# EAGLE design ServoBoard-Rev4 (EAGLE 9.5.1)
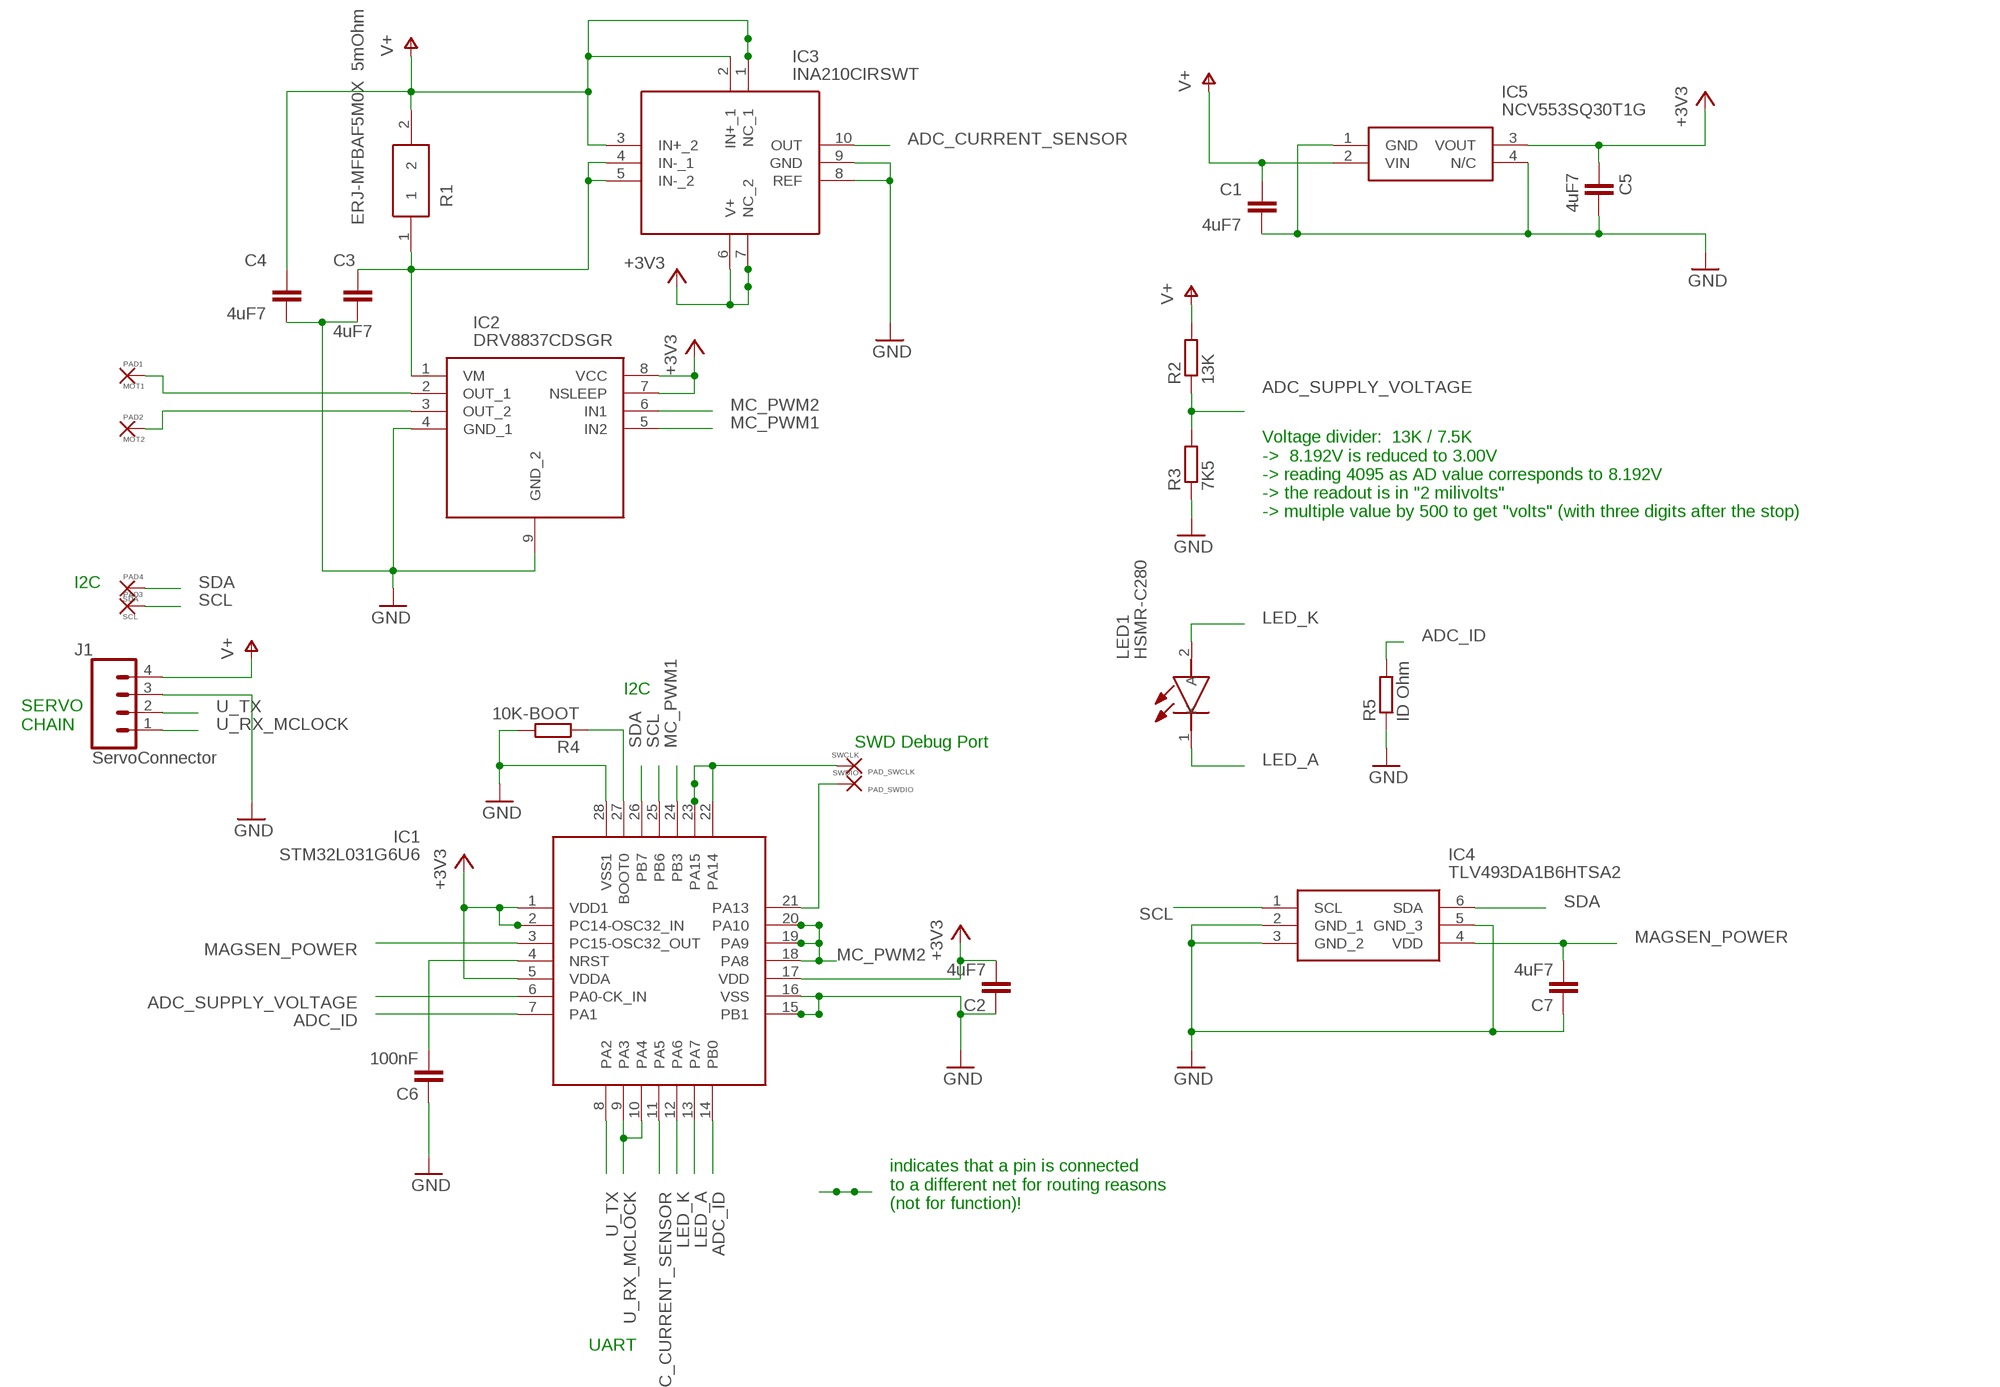
[diagram p0: schematic, sheet 1]

## Parts
C1  4uF7  C-EUC0402  [C0402]
C2  4uF7  C-EUC0402  [C0402]
C3  4uF7  C-EUC0402  [C0402]
C4  4uF7  C-EUC0402  [C0402]
C5  4uF7  C-EUC0402  [C0402]
C6  100nF  C-EUC0201  [C0201]
C7  4uF7  C-EUC0402  [C0402]
IC1  STM32L031G6U6  [QFN50P400X400X60-28N]
IC2  DRV8837CDSGR  [SON50P200X200X80-9N]
IC3  INA210CIRSWT  [QFN40P140X180X55-10N]
IC4  TLV493DA1B6HTSA2  [SOT95P250X110-6N]
IC5  NCV553SQ30T1G  [NCP563SQ18T1G]
J1  ServoConnector  CONN_04SMD2  [JST04_SH_1MM]
LED1  HSMR-C280  [LEDC1005X50N]
PAD1  MOT1  SMD-PAD12X07  [SMD12X07]
PAD2  MOT2  SMD-PAD12X07  [SMD12X07]
PAD3  SCL  SMD-PAD14X06  [SMD14X06]
PAD4  SDA  SMD-PAD14X06  [SMD14X06]
PAD_SWCLK  SWCLK  SMD-PAD06X06  [SMD06X06]
PAD_SWDIO  SWDIO  SMD-PAD06X06  [SMD06X06]
R1  ERJ-MFBAF5M0X 5mOhm  ERJ-MFBAF5M0X  [RESM106X40N]
R2  13K  R-EU_R0402  [R0402]
R3  7K5  R-EU_R0402  [R0402]
R4  10K-BOOT  R-EU_R0402  [R0402]
R5  ID Ohm  R-EU_R0402  [R0402]

## Nets
+3V3: C2.2 C5.1 IC1.1(VDD1) IC1.2(PC14-OSC32_IN) IC1.5(VDDA) IC1.17(VDD) IC2.7(NSLEEP) IC2.8(VCC) IC3.6(V+) IC3.7(NC_2) IC5.3(VOUT)
ADC_CURRENT_SENSOR: IC1.11(PA5) IC3.10(OUT)
ADC_ID: IC1.7(PA1) IC1.14(PB0) R5.2
ADC_SUPPLY_VOLTAGE: IC1.6(PA0-CK_IN) R2.1 R3.2
BOOT0: IC1.27(BOOT0) R4.1
GND: C1.2 C2.1 C3.2 C4.2 C5.2 C6.1 C7.1 IC1.15(PB1) IC1.16(VSS) IC1.28(VSS1) IC2.4(GND_1) IC2.9(GND_2) IC3.8(REF) IC3.9(GND) IC4.2(GND_1) IC4.3(GND_2) IC4.5(GND_3) IC5.1(GND) IC5.4(N/C) J1.3 R3.1 R4.2 R5.1
LED_A: IC1.13(PA7) LED1.1(K)
LED_K: IC1.12(PA6) LED1.2(A)
MAGSEN_POWER: C7.2 IC1.3(PC15-OSC32_OUT) IC4.4(VDD)
MC_PWM1: IC1.24(PB3) IC2.5(IN2)
MC_PWM2: IC1.18(PA8) IC1.19(PA9) IC1.20(PA10) IC2.6(IN1)
MOTOR_1: IC2.2(OUT_1) PAD1.1(P)
MOTOR_2: IC2.3(OUT_2) PAD2.1(P)
NRST: C6.2 IC1.4(NRST)
SCL: IC1.25(PB6) IC4.1(SCL) PAD3.1(P)
SDA: IC1.26(PB7) IC4.6(SDA) PAD4.1(P)
SWCLK: IC1.22(PA14) IC1.23(PA15) PAD_SWCLK.1(P)
SWDIO: IC1.21(PA13) PAD_SWDIO.1(P)
U_RX_MCLOCK: IC1.9(PA3) IC1.10(PA4) J1.1
U_TX: IC1.8(PA2) J1.2
V+: C1.1 C4.1 IC3.1(NC_1) IC3.2(IN+_1) IC3.3(IN+_2) IC5.2(VIN) J1.4 R1.2 R2.2
V_SENSOR: C3.1 IC2.1(VM) IC3.4(IN-_1) IC3.5(IN-_2) R1.1

## Notes on the sheet
- Voltage divider:  13K / 7.5K 
  ->  8.192V is reduced to 3.00V
  -> reading 4095 as AD value corresponds to 8.192V
  -> the readout is in "2 milivolts"
  -> multiple value by 500 to get "volts" (with three digits after the stop)
- I2C
- I2C
- SERVO
  CHAIN
- SWD Debug Port
- indicates that a pin is connected
  to a different net for routing reasons
  (not for function)!
- UART

## Library data of the parts
C1-C7 = rcl:C-EU: CAPACITOR, European symbol; SPICEPREFIX: C
IC1 = HBPMouse:STM32L031G6U6: ARM Microcontrollers - MCU Ultra-low-power ARM Cortex-M0+ MCU with 32-Kbytes Flash, 32 MHz CPU Source: Datasheet <http://www.mouser.com/datasheet/2/389/stm32l031g4-956322.pdf>; DESCRIPTION: ARM Microcontrollers - MCU Ultra-low-power ARM Cortex-M0+ MCU with 32-Kbytes Flash, 32 MHz CPU; HEIGHT: 0.6mm; MANUFACTURER_NAME: STMicroelectronics; MANUFACTURER_PART_NUMBER: STM32L031G6U6; MOUSER_PART_NUMBER: 511-STM32L031G6U6; MOUSER_PRICE-STOCK: https://www.mouser.com/Search/Refine.aspx?Keyword=511-STM32L031G6U6
IC2 = HBPMouse:DRV8837CDSGR: 1A Low-Voltage H-Bridge Driver Source: Datasheet <http://www.ti.com/lit/gpn/drv8837c>; DESCRIPTION: 1A Low-Voltage H-Bridge Driver; HEIGHT: 0.8mm; MANUFACTURER_NAME: Texas Instruments; MANUFACTURER_PART_NUMBER: DRV8837CDSGR; MOUSER_PART_NUMBER: 595-DRV8837CDSGR; MOUSER_PRICE-STOCK: https://www.mouser.com/Search/Refine.aspx?Keyword=595-DRV8837CDSGR
IC3 = HBPMouse:INA210CIRSWT: Current Sense Amplifiers 26-V, Bi-Directional, Zero-Drift, High Accuracy, Low-/High-Side, Voltage Out Current Shunt Monitor 10-UQFN -40 to 125 Source: Datasheet <http://www.ti.com/lit/ds/sbos437j/sbos437j.pdf>; DESCRIPTION: Current Sense Amplifiers 26-V, Bi-Directional, Zero-Drift, High Accuracy, Low-/High-Side, Voltage Out Current Shunt Monitor 10-UQFN -40 to 125; HEIGHT: 0.55mm; MANUFACTURER_NAME: Texas Instruments; MANUFACTURER_PART_NUMBER: INA210CIRSWT; MOUSER_PART_NUMBER: 595-INA210CIRSWT; MOUSER_PRICE-STOCK: https://www.mouser.com/Search/Refine.aspx?Keyword=595-INA210CIRSWT
IC4 = HBPMouse:TLV493DA1B6HTSA2: Board Mount Hall Effect / 3D Magnetic Sensor Source: Datasheet <https://componentsearchengine.com/Datasheets/1/TLV493DA1B6HTSA2.pdf>; DESCRIPTION: Board Mount Hall Effect / 3D Magnetic Sensor; HEIGHT: 1.1mm; MANUFACTURER_NAME: Infineon; MANUFACTURER_PART_NUMBER: TLV493DA1B6HTSA2; MOUSER_PART_NUMBER: 726-TLV493DA1B6HTSA2; MOUSER_PRICE-STOCK: https://www.mouser.com/Search/Refine.aspx?Keyword=726-TLV493DA1B6HTSA2
IC5 = HBPMouse:NCV553SQ30T1G: LDO Voltage Regulators LDO LINEAR REGULATOR Source: Datasheet <https://componentsearchengine.com/Datasheets/1/NCV553SQ30T1G.pdf>; DESCRIPTION: LDO Voltage Regulators LDO LINEAR REGULATOR; HEIGHT: mm; MANUFACTURER_NAME: ON Semiconductor; MANUFACTURER_PART_NUMBER: NCV553SQ30T1G; MOUSER_PART_NUMBER: 863-NCV553SQ30T1G; MOUSER_PRICE-STOCK: https://www.mouser.com/Search/Refine.aspx?Keyword=863-NCV553SQ30T1G
J1 = HBPMouse:CONN_04: Multi connection point. Often used as Generic Header-pin footprint for 0.1 inch spaced/style header connections On any of the 0.1 inch spaced packages, you can populate with these: Break Away Headers - Straight <https://www.sparkfun.com/products/116> (PRT-00116) Break Away Male Headers - Right Angle <https://www.sparkfun.com/products/553> (PRT-00553) Female Headers <https://www.sparkfun.com/products/115> (PRT-00115) Break Away Headers - Machine Pin <https://www.sparkfun.com/products/117> (PRT-00117) Break Away Female Headers - Swiss Machine Pin <https://www.sparkfun.com/products/743> (PRT-00743) For SCREWTERMINALS and SPRING TERMINALS visit here: Screw Terimnals on SparkFun.com <https://www.sparkfun.com/search/results?term=Screw+Terminals> (5mm/3.5mm/2.54mm spacing) This device is also useful as a general connection point to wire up your design to another part of your project. Our various solder wires solder well into these plated through hole pads. Hook-Up Wire - Assortment (Stranded, 22 AWG) <https://www.sparkfun.com/products/11375> (PRT-11375) Hook-Up Wire - Assortment (Solid Core, 22 AWG) <https://www.sparkfun.com/products/11367> (PRT-11367) View the entire wire category on our website here <https://www.sparkfun.com/categories/141> Special notes: Molex polarized connector foot print use with SKU : PRT-08231 with associated crimp pins and housings. 1MM SMD Version SKU: PRT-10208; PROD_ID: CONN-10310; SF_ID: PRT-10208
LED1 = HBPMouse:HSMR-C280: BROADCOM LIMITED - HSMR-C280 - LED, BLUE, 80MCD, 465NM, 0402 Source: Datasheet <https://media.digikey.com/pdf/Data Sheets/Avago PDFs/HSMR-C280.pdf>; DESCRIPTION: BROADCOM LIMITED - HSMR-C280 - LED, BLUE, 80MCD, 465NM, 0402; HEIGHT: 0.5mm; MANUFACTURER_NAME: Avago Technologies; MANUFACTURER_PART_NUMBER: HSMR-C280; MOUSER_PART_NUMBER: 630-HSMR-C280; MOUSER_PRICE-STOCK: https://www.mouser.com/Search/Refine.aspx?Keyword=630-HSMR-C280
PAD1-PAD4 PAD_SWCLK PAD_SWDIO = HBPMouse:SMD-PAD: SMD PAD
R1 = HBPMouse:ERJ-MFBAF5M0X: Current Sense Resistors - SMD 0402 1% 0.005ohm Curr Sense AEC-Q200 Source: Datasheet <https://componentsearchengine.com/Datasheets/1/ERJ-MFBAF5M0X.pdf>; DESCRIPTION: Current Sense Resistors - SMD 0402 1% 0.005ohm Curr Sense AEC-Q200; HEIGHT: 0.4mm; MANUFACTURER_NAME: Panasonic; MANUFACTURER_PART_NUMBER: ERJ-MFBAF5M0X; MOUSER_PART_NUMBER: 667-ERJ-MFBAF5M0X; MOUSER_PRICE-STOCK: https://www.mouser.com/Search/Refine.aspx?Keyword=667-ERJ-MFBAF5M0X
R2-R5 = rcl:R-EU_: RESISTOR, European symbol; SPICEPREFIX: R

## Board
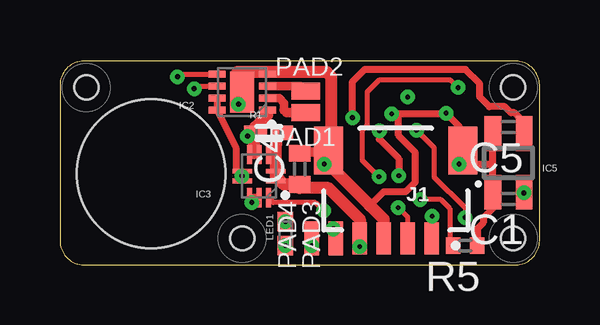
[diagram p1: board, top side]
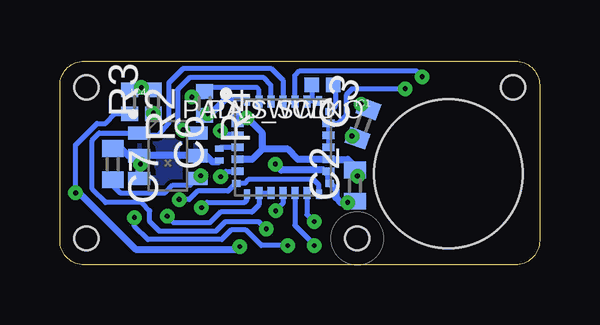
[diagram p2: board, bottom side, seen from below]

Size 20 x 8.5 mm. Coordinates in mm from the lower left corner, seen from the top.
Outline: 20,7.5 arc90 19,8.5 1,8.5 arc90 0,7.5 0,1 arc90 1,0 19,0 arc90 20,1 20,7.5
Copper layers (1*16): Top 0.035mm / dielectric 0.8mm / Bottom 0.035mm
Design rules "default *": minimum track width 0.2mm, minimum drill 0.2mm, track to track 0.15mm, track to pad 0.15mm, pad to pad 0.15mm, via to via 0.15mm, smd to smd 0mil, copper to edge 0.2mm, drill to drill 0.3mm, minimum pad ring 10mil, minimum via ring 8mil, stop-mask expansion 0.02mm, vias tented up to drill 0.5mm, thermal gap 10mil
Holes 1 mm at 1.1,7.4 7.6,1.1 18.9,1.1 18.9,7.4
Holes 6.2 mm at 3.8,3.8

### Footprints (pad centres in the part's own frame; a part is rotated, then mirrored left to right if it is on the bottom)
C0402 = smd 0.7 x 0.9: 1 -0.65,0; 2 0.65,0
C0201 = smd 0.25 x 0.35: 1 -0.25,0; 2 0.25,0
QFN50P400X400X60-28N = smd 0.4 x 0.3: 1 -1.95,1.5; 7 -1.95,-1.5; 15 1.95,-1.5; 21 1.95,1.5 | smd 0.5 x 0.3: 2 -1.9,1; 3 -1.9,0.5; 4 -1.9,0; 5 -1.9,-0.5; 6 -1.9,-1; 16 1.9,-1; 17 1.9,-0.5; 18 1.9,0; 19 1.9,0.5; 20 1.9,1 | smd 0.3 x 0.4: 8 -1.5,-1.95; 14 1.5,-1.95; 22 1.5,1.95; 28 -1.5,1.95 | smd 0.3 x 0.5: 9 -1,-1.9; 10 -0.5,-1.9; 11 0,-1.9; 12 0.5,-1.9; 13 1,-1.9; 23 1,1.9; 24 0.5,1.9; 25 0,1.9; 26 -0.5,1.9; 27 -1,1.9
SON50P200X200X80-9N = smd 0.7 x 0.3: 1 -1.05,0.75; 2 -1.05,0.25; 3 -1.05,-0.25; 4 -1.05,-0.75; 5 1.05,-0.75; 6 1.05,-0.25; 7 1.05,0.25; 8 1.05,0.75 | smd 1 x 1.7: 9 0,0
QFN40P140X180X55-10N = smd 0.8 x 0.2: 1 -0.7,0.2; 2 -0.7,-0.2; 6 0.7,-0.2; 7 0.7,0.2 | smd 0.2 x 0.8: 3 -0.4,-0.9; 4 0,-0.9; 5 0.4,-0.9; 8 0.4,0.9; 9 0,0.9; 10 -0.4,0.9
SOT95P250X110-6N = smd 0.9 x 0.55: 1 -1.2,0.95; 2 -1.2,0; 3 -1.2,-0.95; 4 1.2,-0.95; 5 1.2,0; 6 1.2,0.95
NCP563SQ18T1G = smd 0.7 x 0.9: 1 -0.65,-0.95; 2 0.65,-0.95; 3 0.65,0.95; 4 -0.65,0.95
JST04_SH_1MM = smd 0.6 x 1.35: 1 -1.5,0; 2 -0.5,0; 3 0.5,0; 4 1.5,0 | smd 1.2 x 2: NC1 2.8,-3.675; NC2 -2.8,-3.675
LEDC1005X50N = smd 0.8 x 0.65: 1 -0.5,0; 2 0.5,0
SMD12X07 = smd 0.7 x 1.2: 1 0,0
SMD14X06 = smd 0.6 x 1.4: 1 0,0
SMD06X06 = smd 0.6 x 0.6: 1 0,0
RESM106X40N = smd 0.95 x 0.6: 1 -0.55,0; 2 0.55,0
R0402 = smd 0.6 x 0.7: 1 -0.5,0; 2 0.5,0

### Placement (x,y rotation side)
C1  18.7,2.75 180 top
C2  7.7,3.3 90 bottom
C3  7.37,5.89 70 bottom
C4  10,4 90 top
C5  18.7,5.75 180 top
C6  13.35,4.6 90 bottom
C7  17.8,4.2 270 bottom
IC1  10.7,4.9 0 bottom
IC2  7.6,7.2 180 top
IC3  8.3,3.7 180 top
IC4  15.5,4.55 0 bottom
IC5  18.7,4.25 0 top
J1  14,1.1 180 top
LED1  9.4,1.3 270 top
PAD1  10.25,6.35 90 top
PAD2  10.25,7.25 270 top
PAD3  11.5,1.1 0 top
PAD4  10.5,1.1 0 top
PAD_SWCLK  9.5,7.5 90 bottom
PAD_SWDIO  8.6,7.5 90 bottom
R1  8.7,5.5 0 top
R2  17.1,6.8 270 bottom
R3  16.1,6.8 90 bottom
R4  13.97,6.73 270 bottom
R5  16.9,0.8 180 top

### Tracks (layer width: path | path; a pad name or v marks a point on that pad's centre or on a via)
+3V3  (via drill 0.2)
  Top 0.2: IC3.6 7.59,3.89 v7.59,3.7 7.59,3.51 IC3.7
  Top 0.3: IC2.7 IC2.8 7.35,4.85 7.35,3.94 v7.59,3.7 | 19.3,6 18.95,6.35 18.81,6.35 18.56,6.6 17.9,6.6 17.5,7 17.5,7.56 16.91,8.15 12.7,8.15 12.2,7.65 v12.2,6.14
  Top 0.4: IC5.3 C5.1 19.35,5.95 19.3,6
  Bottom 0.2: IC1.2 12.68,5.98 12.7,5.98
  Bottom 0.3: IC1.5 11.98,4.4 11.55,4.83 | C2.2 7.7,3.81 v7.59,3.7 7.6,3.71 7.6,4 8,4.4 IC1.17 10.07,4.4 10.5,4.83 11.55,4.83 | IC1.1 12.65,5.98 | 12.7,5.98 12.65,5.98 | 12.65,5.98 12.37,5.98 v12.2,6.14 | IC1.2 12.44,5.9 v12.2,6.14 | 11.55,4.83 11.55,5.49 v12.2,6.14
ADC_CURRENT_SENSOR  (via drill 0.2)
  Top 0.2: IC3.10 8.9,2.6 10.65,2.6 v11,2.25
  Bottom 0.2: v11,2.25 10.7,2.55 IC1.11
ADC_ID  (via drill 0.2)
  Top 0.2: v15.03,2.73 15.88,2.73 16.25,2.35 16.25,0.95 R5.2
  Bottom 0.2: v15.03,2.73 14.61,2.73 14.26,3.08 13,3.08 12.68,3.4 IC1.7 12.3,3.4 12.15,3.55 9.42,3.55 9.2,3.33 IC1.14
ADC_SUPPLY_VOLTAGE  (via drill 0.2)
  Top 0.2: v16.6,7.4 16.3,7.7 13.3,7.7 12.81,7.21 12.81,5.81 12.6,5.6 12.6,4.38 v13.3,3.67
  Bottom 0.2: v16.6,7.4 16.5,7.3 R3.2 R2.1 | v13.3,3.67 13.07,3.9 IC1.6
BOOT0  (via drill 0.2)
  Bottom 0.2: IC1.27 11.7,7.3 11.8,7.4 13.8,7.4 R4.1 | R4.1 | R4.1 13.99,7 v14.5,7
GND  (via drill 0.2)
  Top 0.2: C1.2 IC5.1 | IC3.9 8.2,2.8 | IC2.4 8.6,8 8.6,8.05
  Top 0.3: C4.2 10,4.7 | C5.2 IC5.4 18.05,4.2 | IC5.1 18.05,4.2 | v8,2.6 8,2.7 IC3.8 8.2,2.8 | C1.2 18.05,2.35 17.65,1.95 17.65,1.75 17.4,1.5 R5.1 | 18.05,4.2 v16.65,4.2 16.65,5.78 v16.1,6.33 16.07,6.3 14.12,6.3 | v13.83,6.3 14.12,6.3 | 12.93,2.48 13.49,3.04 14.41,3.04 14.81,3.44 14.81,4.71 14.12,5.4 14.12,6.3
  Top 0.4: 7.6,7.5 IC2.9 7.44,7.04 v7.44,6.7 | 10,4.7 11.3,4.7
  Top 0.5: J1.3 13.5,1.9 12.93,2.48 11.2,4.2 v11.02,4.2 11.3,4.48 11.3,4.7 11.3,7.87 11.12,8.05 8.6,8.05 7.4,8.05 7.6,7.85 7.6,7.5
  Bottom 0.2: C6.1 13.4,4.3
  Bottom 0.3: IC4.2 IC4.5 13.9,4.55 13.65,4.3 13.4,4.3 | IC4.2 IC4.3 16.7,4.2 v16.65,4.2 | IC4.2 17.15,4.55 17.45,4.85 C7.1 | v11.02,4.2 10.77,3.95 9,3.95 8.95,3.9 | C3.2 7.25,6.5 v7.44,6.7 | 8.95,3.9 8.78,3.73 8.78,3.42 IC1.15 8.5,3.15 8.5,2.8 8.3,2.6 v8,2.6 7.95,2.65 C2.1 | 8.95,3.9 IC1.16 | R3.1 v16.1,6.33 | IC1.28 12.3,6.95 13.06,6.95 13.8,6.21 13.8,6.2 13.94,6.2 R4.2 13.9,6.3 v13.83,6.3
  pour Bottom: 14.3,5.2 14.3,3.4 16.7,3.4 16.7,5.2
LED_A  (via drill 0.2)
  Bottom 0.2: LED1.1 9.7,2.1 IC1.13
  other vias: 9.4,1.8
LED_K  (via drill 0.2)
  Bottom 0.2: IC1.12 10.2,1.65 9.4,0.85 LED1.2
  other vias: 9.4,0.8
MAGSEN_POWER  (via drill 0.2)
  Top 0.3: v13.32,5.59 13.32,5.24 14.13,4.43 v14.13,3.72
  Bottom 0.2: C7.2 17.8,3.3 17.5,3 15.62,3 15.3,3.33 14.57,3.33 IC4.4
  Bottom 0.3: v14.13,3.72 14.13,3.63 14.1,3.6 IC4.4 | IC1.3 13.13,5.4 v13.32,5.59
MC_PWM1  (via drill 0.2)
  Top 0.2: v4.9,7.85 5,7.95 IC2.5
  Bottom 0.2: IC1.24 10.2,7.9 10,8.1 5.15,8.1 v4.9,7.85
MC_PWM2  (via drill 0.2)
  Top 0.2: v5.6,7.35 5.7,7.45 IC2.6
  Bottom 0.2: v5.6,7.35 v5.6,7.34 7.8,7.34 8.07,7.08 8.07,6.23 8.4,5.9 IC1.20 IC1.19 IC1.18
MOTOR_1
  Top 0.35: IC2.2 9.15,6.95 9.35,6.75 9.35,6.45
  Top 0.4: 9.35,6.45 9.45,6.35 PAD1.1
MOTOR_2
  Top 0.35: IC2.3 10.05,7.45 PAD2.1
NRST
  Bottom 0.2: IC1.4 13.3,4.9 C6.2
SCL  (via drill 0.2)
  Top 0.2: v11.4,1.5 11.4,1.2 PAD3.1
  Bottom 0.2: v11.4,1.5 11.7,1.8 13.11,1.8 13.51,1.4 15.85,1.4 16.25,1.8 16.25,2.25 16.6,2.6 18.1,2.6 18.65,3.15 18.65,5.2 18.36,5.5 IC4.1 16.62,5.42 15.88,5.42 15.45,5.92 15.45,7.6 14.85,8.2 11.2,8.2 10.7,7.7 IC1.25
SDA  (via drill 0.2)
  Top 0.2: PAD4.1 v10.5,0.8 | v14.87,5.62 15.6,4.89 15.6,3.67 16.9,2.37 v16.9,1.97
  Bottom 0.2: v16.9,1.97 16.9,1.62 16.33,1.05 13.26,1.05 12.86,1.45 12.25,1.45 11.6,0.8 v10.5,0.8 | IC4.6 14.75,5.5 v14.87,5.62 15.1,5.85 15.1,7.3 14.6,7.8 11.5,7.8 11.2,7.5 IC1.26
SWCLK
  Bottom 0.2: IC1.22 9.5,6.85 | 9.5,6.85 9.65,6.85 IC1.23 | PAD_SWCLK.1 9.5,6.85
SWDIO
  Bottom 0.2: PAD_SWDIO.1 8.45,7.35 8.5,7.3 8.5,6.65 IC1.21
U_RX_MCLOCK  (via drill 0.2)
  Top 0.2: v15.53,2.02 15.55,2 15.55,1.15 J1.1
  Bottom 0.2: IC1.10 IC1.9 11.7,2.5 12,2.2 13.3,2.2 13.75,1.75 15.25,1.75 v15.52,2.02 v15.53,2.02
U_TX  (via drill 0.2)
  Top 0.2: J1.2 14.5,1.98 v14.1,2.38
  Bottom 0.2: v14.1,2.38 13.88,2.6 12.3,2.6 12.2,2.7 IC1.8
V+  (via drill 0.2)
  Top 0.2: J1.4 v12.5,0.75 | C1.1 v19.35,3 | IC3.3 9,4.6 | IC3.2 9,3.7 IC3.1
  Top 0.3: 10,3.2 C4.1 | C1.1 IC5.2
  Top 0.5: J1.4 12.5,1.9 11.2,3.2 10,3.2 | C4.1 9.35,3.35 9,3.7 9,4.6 9,5.01 9.03,5.03 9.03,5.28 R1.2
  Bottom 0.2: v19.35,3 v19.35,3.01 19.35,5 18.45,5.9 18.1,5.9 17.7,6.3 R2.2
  Bottom 0.3: v19.35,3 19.2,3 16.85,0.65 12.6,0.65 v12.5,0.75
V_SENSOR  (via drill 0.2)
  Top 0.2: IC3.5 8.1,4.6 IC3.4
  Top 0.3: IC2.1 8.6,6.4 8.65,6.35 | 8.15,5.75 R1.1 | 8.1,5 7.82,5.28 v7.82,5.37
  Top 0.4: 8.65,6.35 8.65,6.25 | 8.1,4.6 8.1,5 | 8.1,5.45 R1.1
  Top 0.5: 8.65,6.25 8.15,5.75 | 8.1,5 8.1,5.45
  Bottom 0.3: v7.82,5.37 7.74,5.28 C3.1